# EAGLE design upconverter (EAGLE 6.5.0)
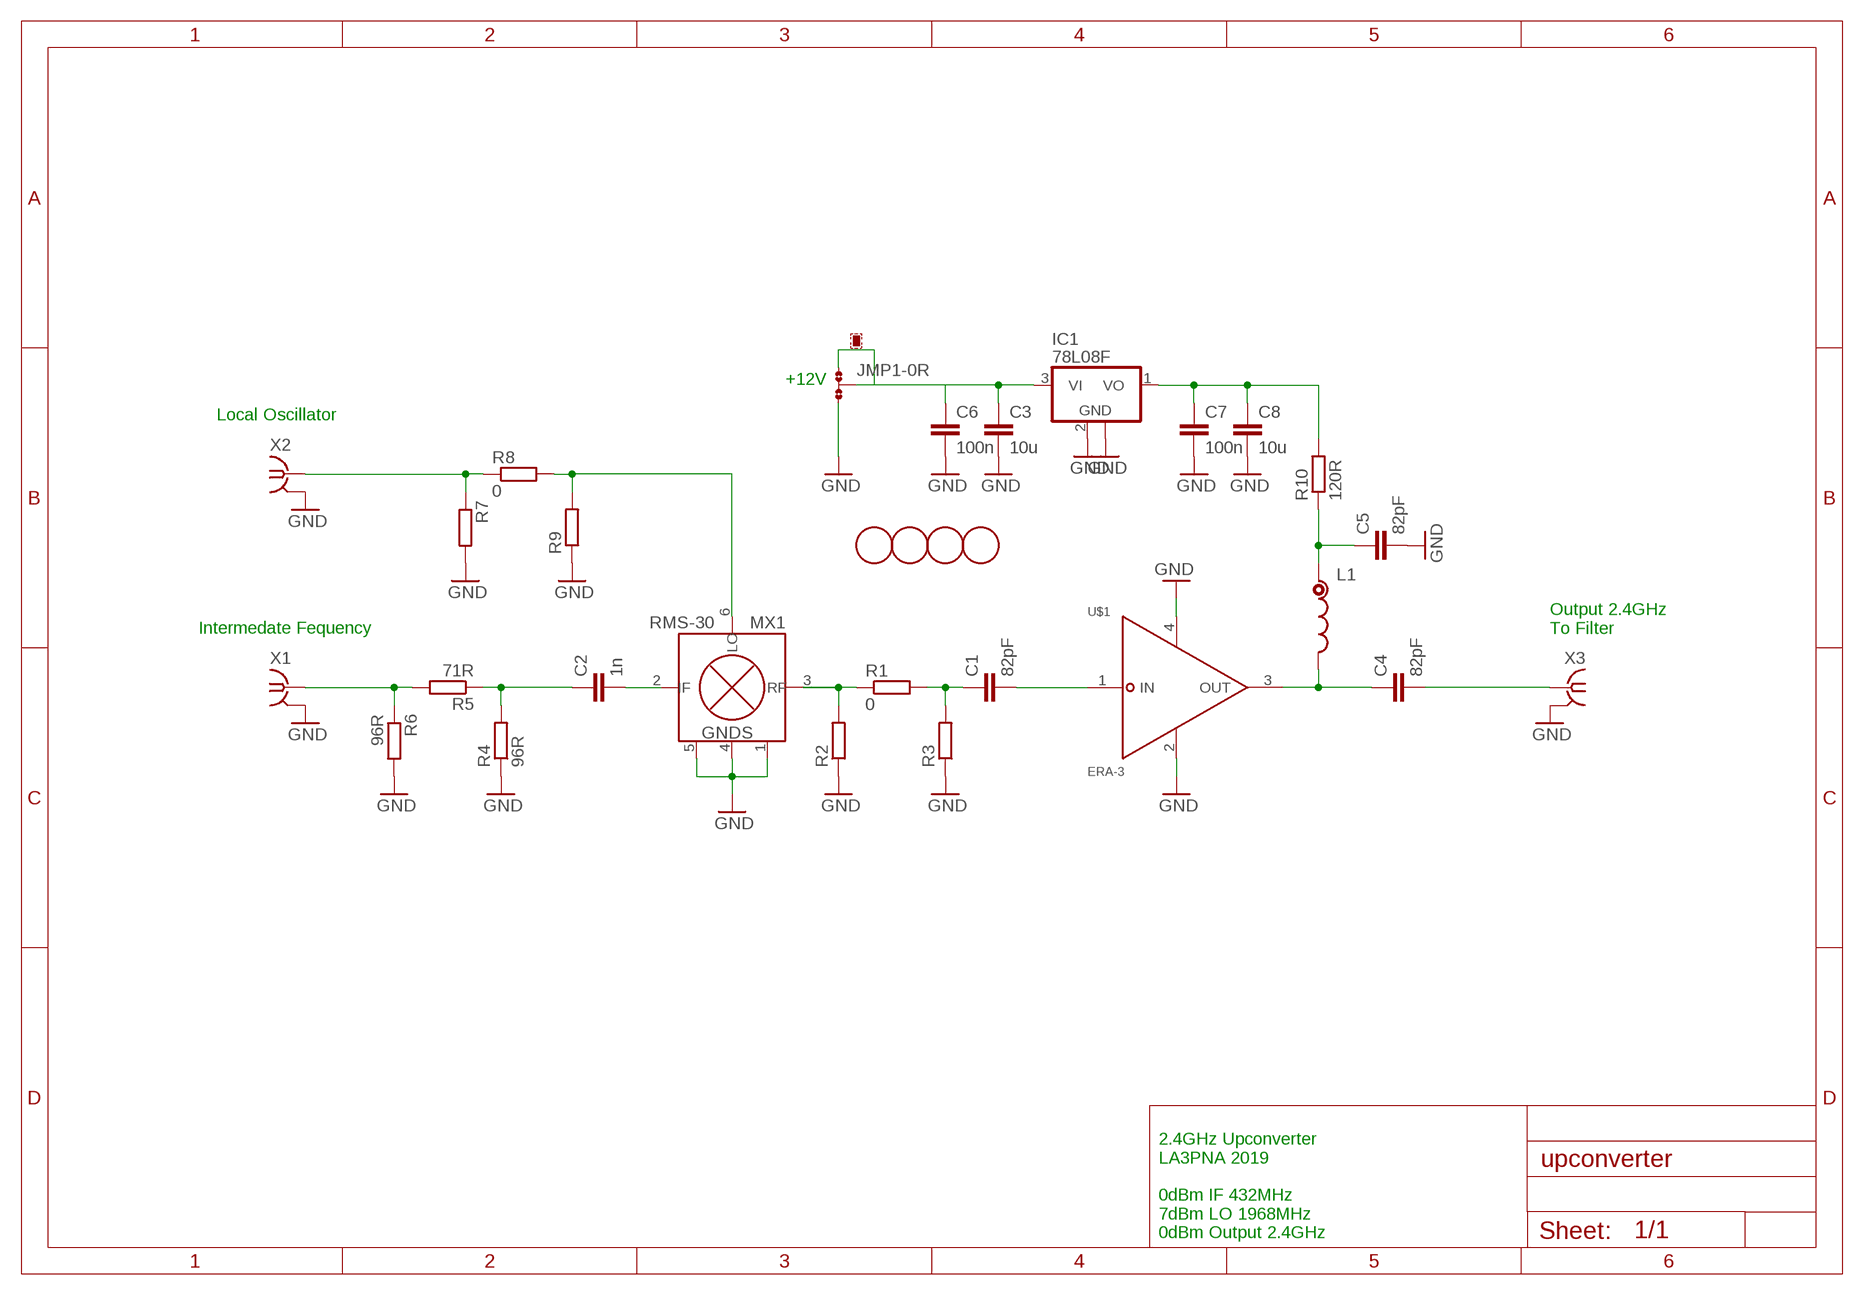
[diagram p0: schematic, sheet 1]

## Parts
C1  82pF  C-EUC0603K  [C0603K]
C2  1n  C-EUC0603K  [C0603K]
C3  10u  C-EUC1210  [C1210]
C4  82pF  C-EUC0805  [C0805]
C5  82pF  C-EUC0603K  [C0603K]
C6  100n  C-EUC0603K  [C0603K]
C7  100n  C-EUC0603K  [C0603K]
C8  10u  C-EUC1210  [C1210]
IC1  78L08F  [SOT89]
JMP1  0R-JUMPA  [A0R-JMP]
L1  INDUCTOR0603  [0603]
MX1  RMS-30  ADE-1  [CD636]
R1  0  R-EU_R1005  [R1005]
R2  R-EU_R1005  [R1005]
R3  R-EU_R1005  [R1005]
R4  96R  R-EU_R1005  [R1005]
R5  71R  R-EU_R1005  [R1005]
R6  96R  R-EU_R1005  [R1005]
R7  R-EU_R1005  [R1005]
R8  0  R-EU_R1005  [R1005]
R9  R-EU_R1005  [R1005]
R10  120R  R-EU_R1206  [R1206]
U$1  ERA-3  MAR4SM  [MAR4SM]
U$2  FIDUCIAL  [FIDUCIAL_1MM]
U$3  FIDUCIAL  [FIDUCIAL_1MM]
U$4  FIDUCIAL  [FIDUCIAL_1MM]
U$5  FIDUCIAL  [FIDUCIAL_1MM]
X1  SMA-142-0711-821/826  [J502-ND-142-0711-821/826]
X2  SMA-142-0711-821/826  [J502-ND-142-0711-821/826]
X3  SMA-142-0711-821/826  [J502-ND-142-0711-821/826]

## Nets
GND: C3.2 C5.2 C6.2 C7.2 C8.2 IC1.2(GND) IC1.2@1(GND) JMP1.3 MX1.1(GND) MX1.4(GND) MX1.5(GND) R2.1 R3.1 R4.1 R6.2 R7.2 R9.1 U$1.2 U$1.4 X1.G@1 X1.G@2 X1.G@3 X1.G@4 X2.G@1 X2.G@2 X2.G@3 X2.G@4 X3.G@1 X3.G@2 X3.G@3 X3.G@4
N$1: C2.1 R4.2 R5.1
N$2: R5.2 R6.1 X1.1
N$3: C2.2 MX1.2(IF)
N$4: C4.1 L1.2 U$1.3(OUT)
N$5: C1.2 U$1.1(IN)
N$6: C1.1 R1.2 R3.2
N$7: MX1.3(RF) R1.1 R2.2
N$8: R7.1 R8.1 X2.1
N$9: MX1.6(LO) R8.2 R9.2
N$10: C5.1 L1.1 R10.1
N$11: C4.2 X3.1
N$12: C7.1 C8.1 IC1.1(VO) R10.2
N$13: C3.1 C6.1 IC1.3(VI) JMP1.1 JMP1.2

## Notes on the sheet
- +12V
- Local Oscillator
- Intermedate Fequency
- Output 2.4GHz 
  To Filter
- 2.4GHz Upconverter
  LA3PNA 2019
  
  0dBm IF 432MHz
  7dBm LO 1968MHz
  0dBm Output 2.4GHz

## Library data of the parts
C1-C8 = rcl:C-EU: CAPACITOR, European symbol
IC1 = linear:78L*: POSITOIV-VOLTAGE REGULATORS Output up to 100 mA Source: http://focus.ti.com/lit/ds/symlink/ua78l05.pdf
JMP1 = jump-0r-smd:0R-JUMP: SMD 0R 0805 Jumper
L1 = aditya_main:INDUCTOR: Inductors Basic Inductor/Choke - 0603 and 1206. Footprints are not proven and vary greatly between part numbers.
MX1 = minickts (2):ADE-1: ADE-1 & ADE-1+ Level 7 Mixer, 0.5 - 500 MHz
R1-R10 = rcl:R-EU_: RESISTOR, European symbol
U$1 = lasser:MAR4SM: Mini-Circuits MAR4SM Broadband Amplifier DC to 1GHz, 8dB Gain
U$2-U$5 = adafruit:FIDUCIAL: For use by pick and place machines to calibrate the vision/machine, 1mm By microbuilder.eu
X1-X3 = con-coax:SMA-: SMA 50 Ohm End Launch Jack Receptacle - Round Contact Johnson Components Source: www.johnsoncomponents.com .. J502-ND.pdf; MF: JOHNSON COMPONENTS; MPN: 142-0711-821; OC_FARNELL: 1019328; OC_NEWARK: 16F3627

## Board
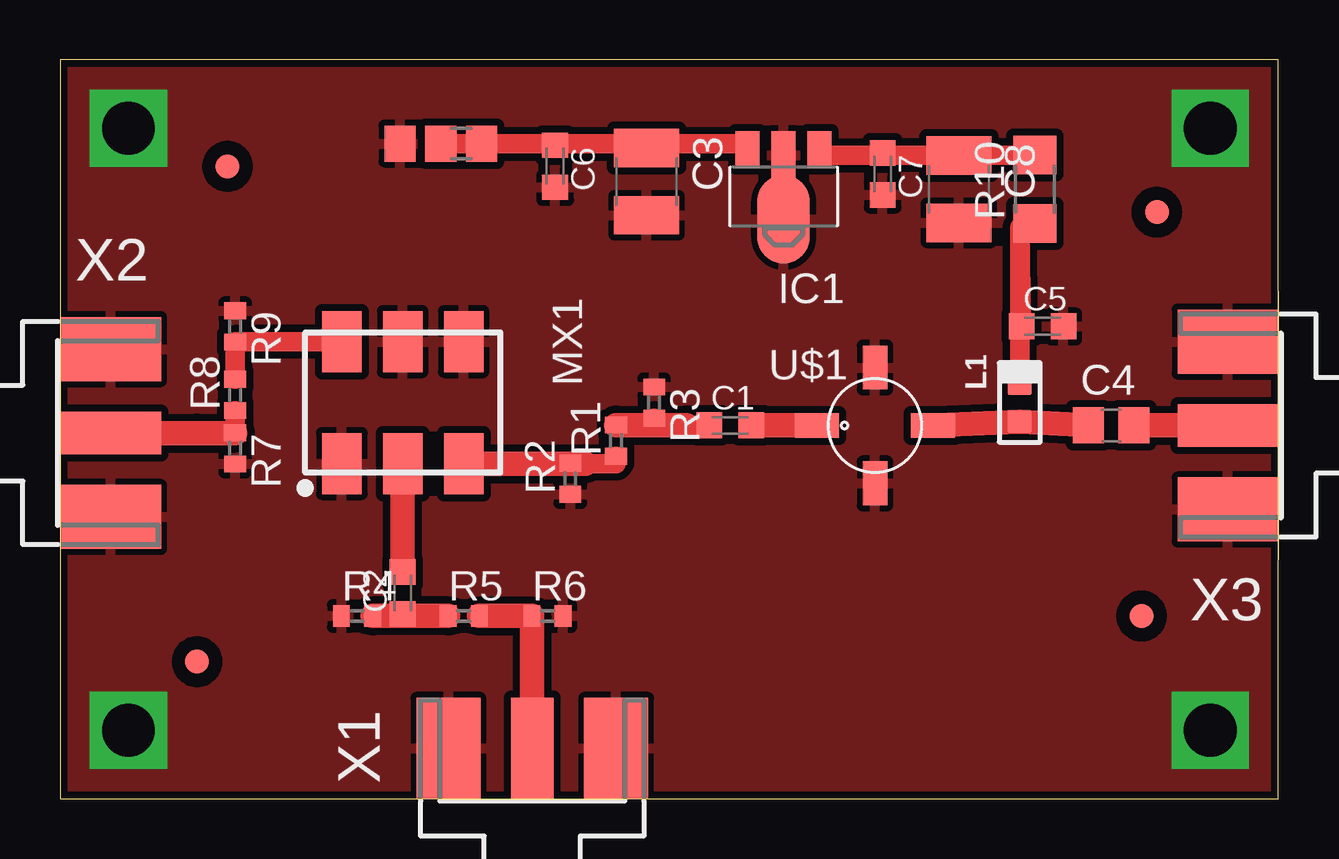
[diagram p1: board, top side]
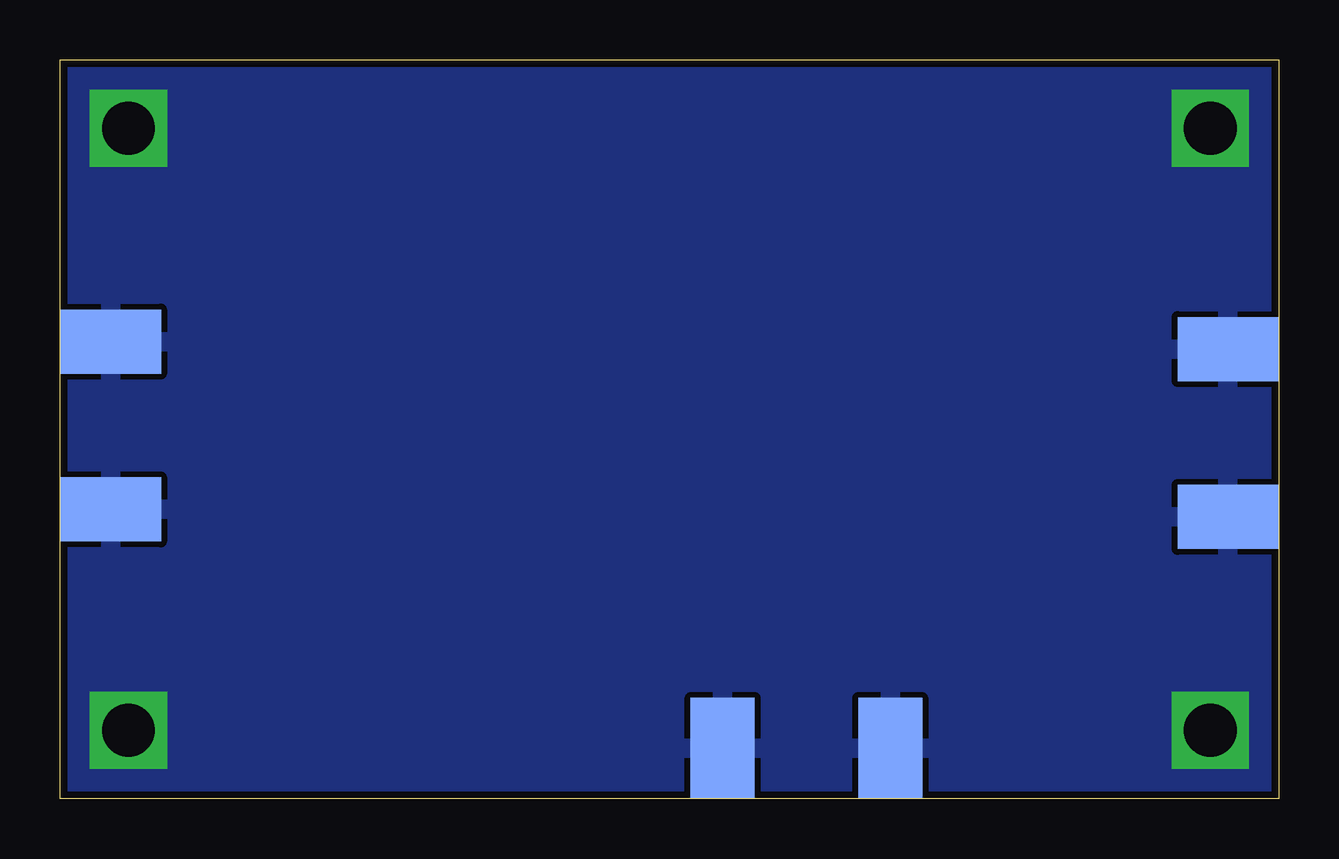
[diagram p2: board, bottom side, seen from below]

Size 50.8 x 30.79 mm. Coordinates in mm from the lower left corner, seen from the top.
Outline: 0,0 50.78,0 50.78,30.79 0,30.79 0,0
Copper layers (1*16): Top 0.035mm / dielectric 1.5mm / Bottom 0.035mm
Design rules "default *": minimum track width 10mil, minimum drill 24mil, track to track 0.3mm, track to pad 0.3mm, pad to pad 0.3mm, via to via 0.3mm, smd to smd 0.3mm, copper to edge 0.3mm, drill to drill 8mil, minimum pad ring 10mil, minimum via ring 8mil, stop-mask expansion 4mil, vias tented up to drill 1mm, thermal gap 10mil

### Footprints (pad centres in the part's own frame; a part is rotated, then mirrored left to right if it is on the bottom)
C0603K = smd 1.05 x 1.08: 1 -0.875,0; 2 0.875,0
C1210 = smd 1.6 x 2.7: 1 -1.4,0; 2 1.4,0
C0805 = smd 1.3 x 1.5: 1 -0.95,0; 2 0.95,0
SOT89 = smd 1 x 1.5: 1 -1.499,-1.981; 3 1.499,-1.981 | smd 1 x 2: 2 0,-1.727 | smd 2.2 x 3.7: 2@1 0,0.94
A0R-JMP = smd 1.5 x 1.3: 1 0,1.7; 2 0,0; 3 0,-1.7
0603 = smd 0.95 x 1: 1 -0.8,0; 2 0.8,0
CD636 = smd 1.651 x 2.54: 1 -2.54,-2.54; 2 0,-2.54; 3 2.54,-2.54; 4 2.54,2.54; 5 0,2.54; 6 -2.54,2.54
R1005 = smd 0.7 x 0.9: 1 -0.65,0; 2 0.65,0
R1206 = smd 1.6 x 1.803: 1 -1.422,0; 2 1.422,0
MAR4SM = smd 1.016 x 1.829: 1 0,-2.413; 3 0,2.413 | smd 1.829 x 1.016: 2 2.413,0; 4 -2.413,0
FIDUCIAL_1MM = smd 1 x 1: 1 0,0
J502-ND-142-0711-821/826 = smd 4.191 x 1.778: 1 2.115,0 | smd 4.191 x 2.667: G@1 2.115,3.495; G@2 2.115,-3.495 | smd 4.191 x 2.667 bottom: G@3 2.115,3.495; G@4 2.115,-3.495

### Placement (x,y rotation side)
C1  27.94,15.56 0 top
C2  14.29,8.57 90 top
C3  24.45,25.72 270 top
C4  43.81,15.56 0 top
C5  40.96,19.68 0 top
C6  20.64,26.35 270 top
C7  34.29,26.04 270 top
C8  37.47,25.4 270 top
IC1  30.16,25.08 180 top
JMP1  15.88,27.3 270 top
L1  40.01,16.51 270 top
MX1  14.29,16.51 0 top
R1  23.18,14.92 90 top
R2  21.27,13.34 90 top
R3  24.77,16.51 270 top
R4  12.38,7.62 0 top
R5  16.83,7.62 0 top
R6  20.32,7.62 0 top
R7  7.3,14.61 270 top
R8  7.3,16.83 90 top
R9  7.3,19.68 270 top
R10  40.64,25.4 90 top
U$1  33.97,15.56 270 top
U$2  45.72,24.45 0 top
U$3  45.09,7.62 0 top
U$4  5.71,5.71 0 top
U$5  6.99,26.35 0 top
X1  19.68,0 90 top
X2  0,15.24 0 top
X3  50.8,15.56 180 top

### Tracks (layer width: path | path; a pad name or v marks a point on that pad's centre or on a via)
GND  (via drill 2.2)
  other vias: 2.86,27.94 2.86,2.86 47.94,2.86 47.94,27.94
  pour Top: -1.59,32.07 51.75,31.75 52.07,-1.59 -1.27,-1.27
  pour Bottom: -0.64,31.43 51.75,31.75 51.75,-0.64 -0.64,-0.64
N$1
  Top 0.813: R4.2 C2.1
  Top 1.016: R5.1 R4.2
N$2
  Top 1.016: R5.2 R6.1 X1.1
N$3
  Top 1.016: C2.2 MX1.2
N$4
  Top 0.813: U$1.3 36.51,15.56 | L1.2
  Top 1.016: 36.51,15.56 L1.2 | L1.2 C4.1
N$5
  Top 1.016: C1.2 U$1.1
N$6
  Top 0.813: 26.11,15.57 C1.1 | R3.2 24.77,15.57
  Top 1.016: R1.2 24.77,15.57 26.11,15.57
N$7
  Top 0.813: R1.1 23.18,13.97 21.91,13.97 R2.2
  Top 1.016: MX1.3 21.91,13.97
N$8
  Top 0.813: 7.3,15.24 R8.1 | R7.1 5.71,15.24
  Top 1.016: X2.1 5.71,15.24 7.3,15.24
N$9
  Top 0.813: MX1.6 8.89,19.05 R9.2 R8.2
N$10
  Top 0.813: L1.1 40.01,23.81 | 40.01,23.81 R10.1 | C5.1 40.01,23.81
N$11
  Top 1.016: C4.2 X3.1
N$12
  Top 0.813: R10.2 38.1,26.82 | 38.1,26.82 34.29,26.82 | IC1.1 31.66,26.82 34.29,26.82 | 34.29,26.82 C7.1 | C8.1 38.1,26.82
N$13
  Top 0.813: JMP1.2 JMP1.1 20.32,27.3 | 20.32,27.3 24.13,27.3 | 24.13,27.3 28.66,27.3 IC1.3 | C3.1 24.13,27.12 24.13,27.3 | C6.1 20.32,27.23 20.32,27.3

### Text on the board
tStop: Upconverter | LA3PNA 2019